# EAGLE schematic rotary_encoder_ver1 (EAGLE 6.1)
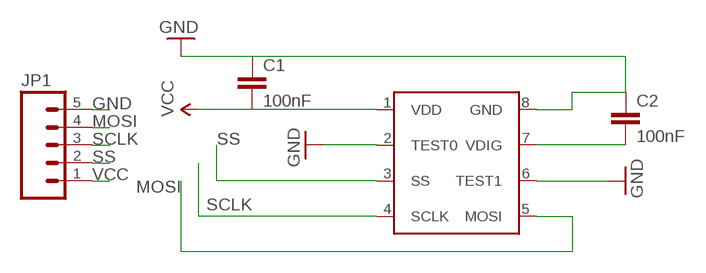
[diagram p0: schematic, sheet 1]

## Parts
C1  100nF  CAP1206  [1206]
C2  100nF  CAP1206  [1206]
JP1  M05PTH  [1X05]
U$1  MLX90316  [8-SOIC_MLX90316]

## Nets
GND: C1.1 C2.1 JP1.5 U$1.2(TEST0) U$1.6(TEST1) U$1.8(GND)
MOSI: JP1.4 U$1.5(MOSI)
N$3: C2.2 U$1.7(VDIG)
SCLK: JP1.3 U$1.4(SCLK)
SS: JP1.2 U$1.3(SS)
VCC: C1.2 JP1.1 U$1.1(VDD)

## Library data of the parts
C1 C2 = SparkFun-Passives:CAP: Capacitor Standard 0603 ceramic capacitor, and 0.1" leaded capacitor.
JP1 = SparkFun-Connectors:M05: Header 5 Standard 5-pin 0.1" header. Use with straight break away headers (SKU : PRT-00116), right angle break away headers (PRT-00553), swiss pins (PRT-00743), machine pins (PRT-00117), and female headers (PRT-00115). Molex polarized connector foot print use with SKU : PRT-08230 with associated crimp pins and housings.
U$1 = tellart:MLX90316